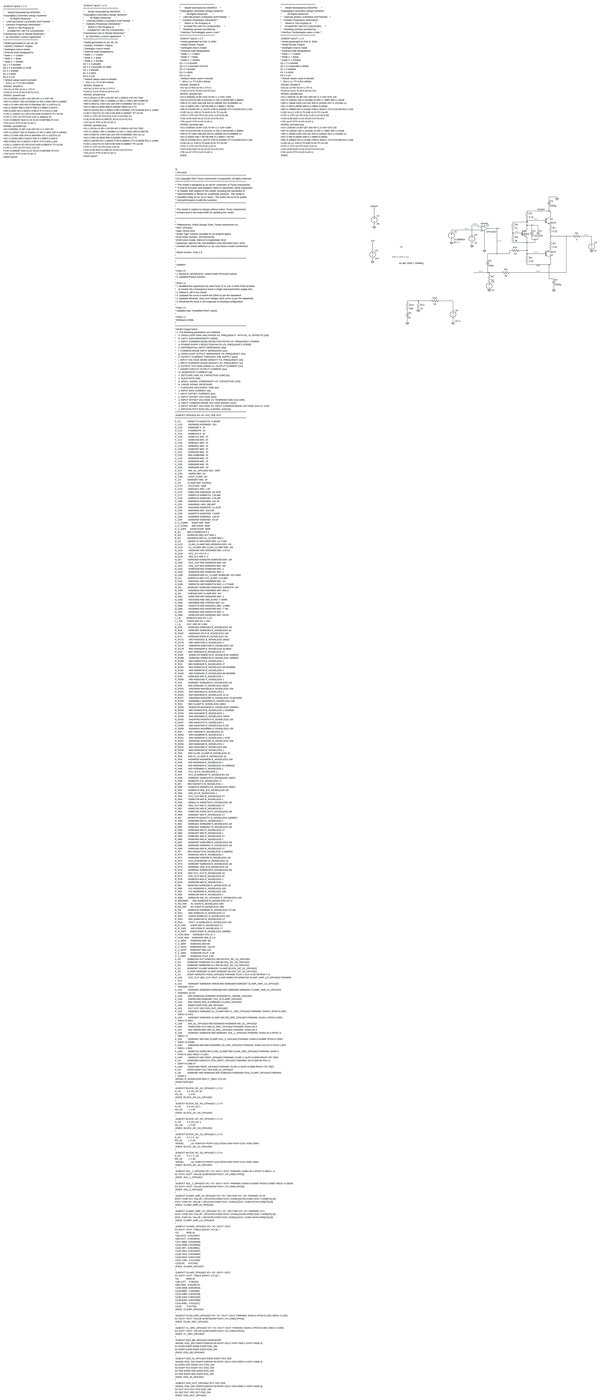
[diagram p0: schematic compensator.asc, whole sheet]
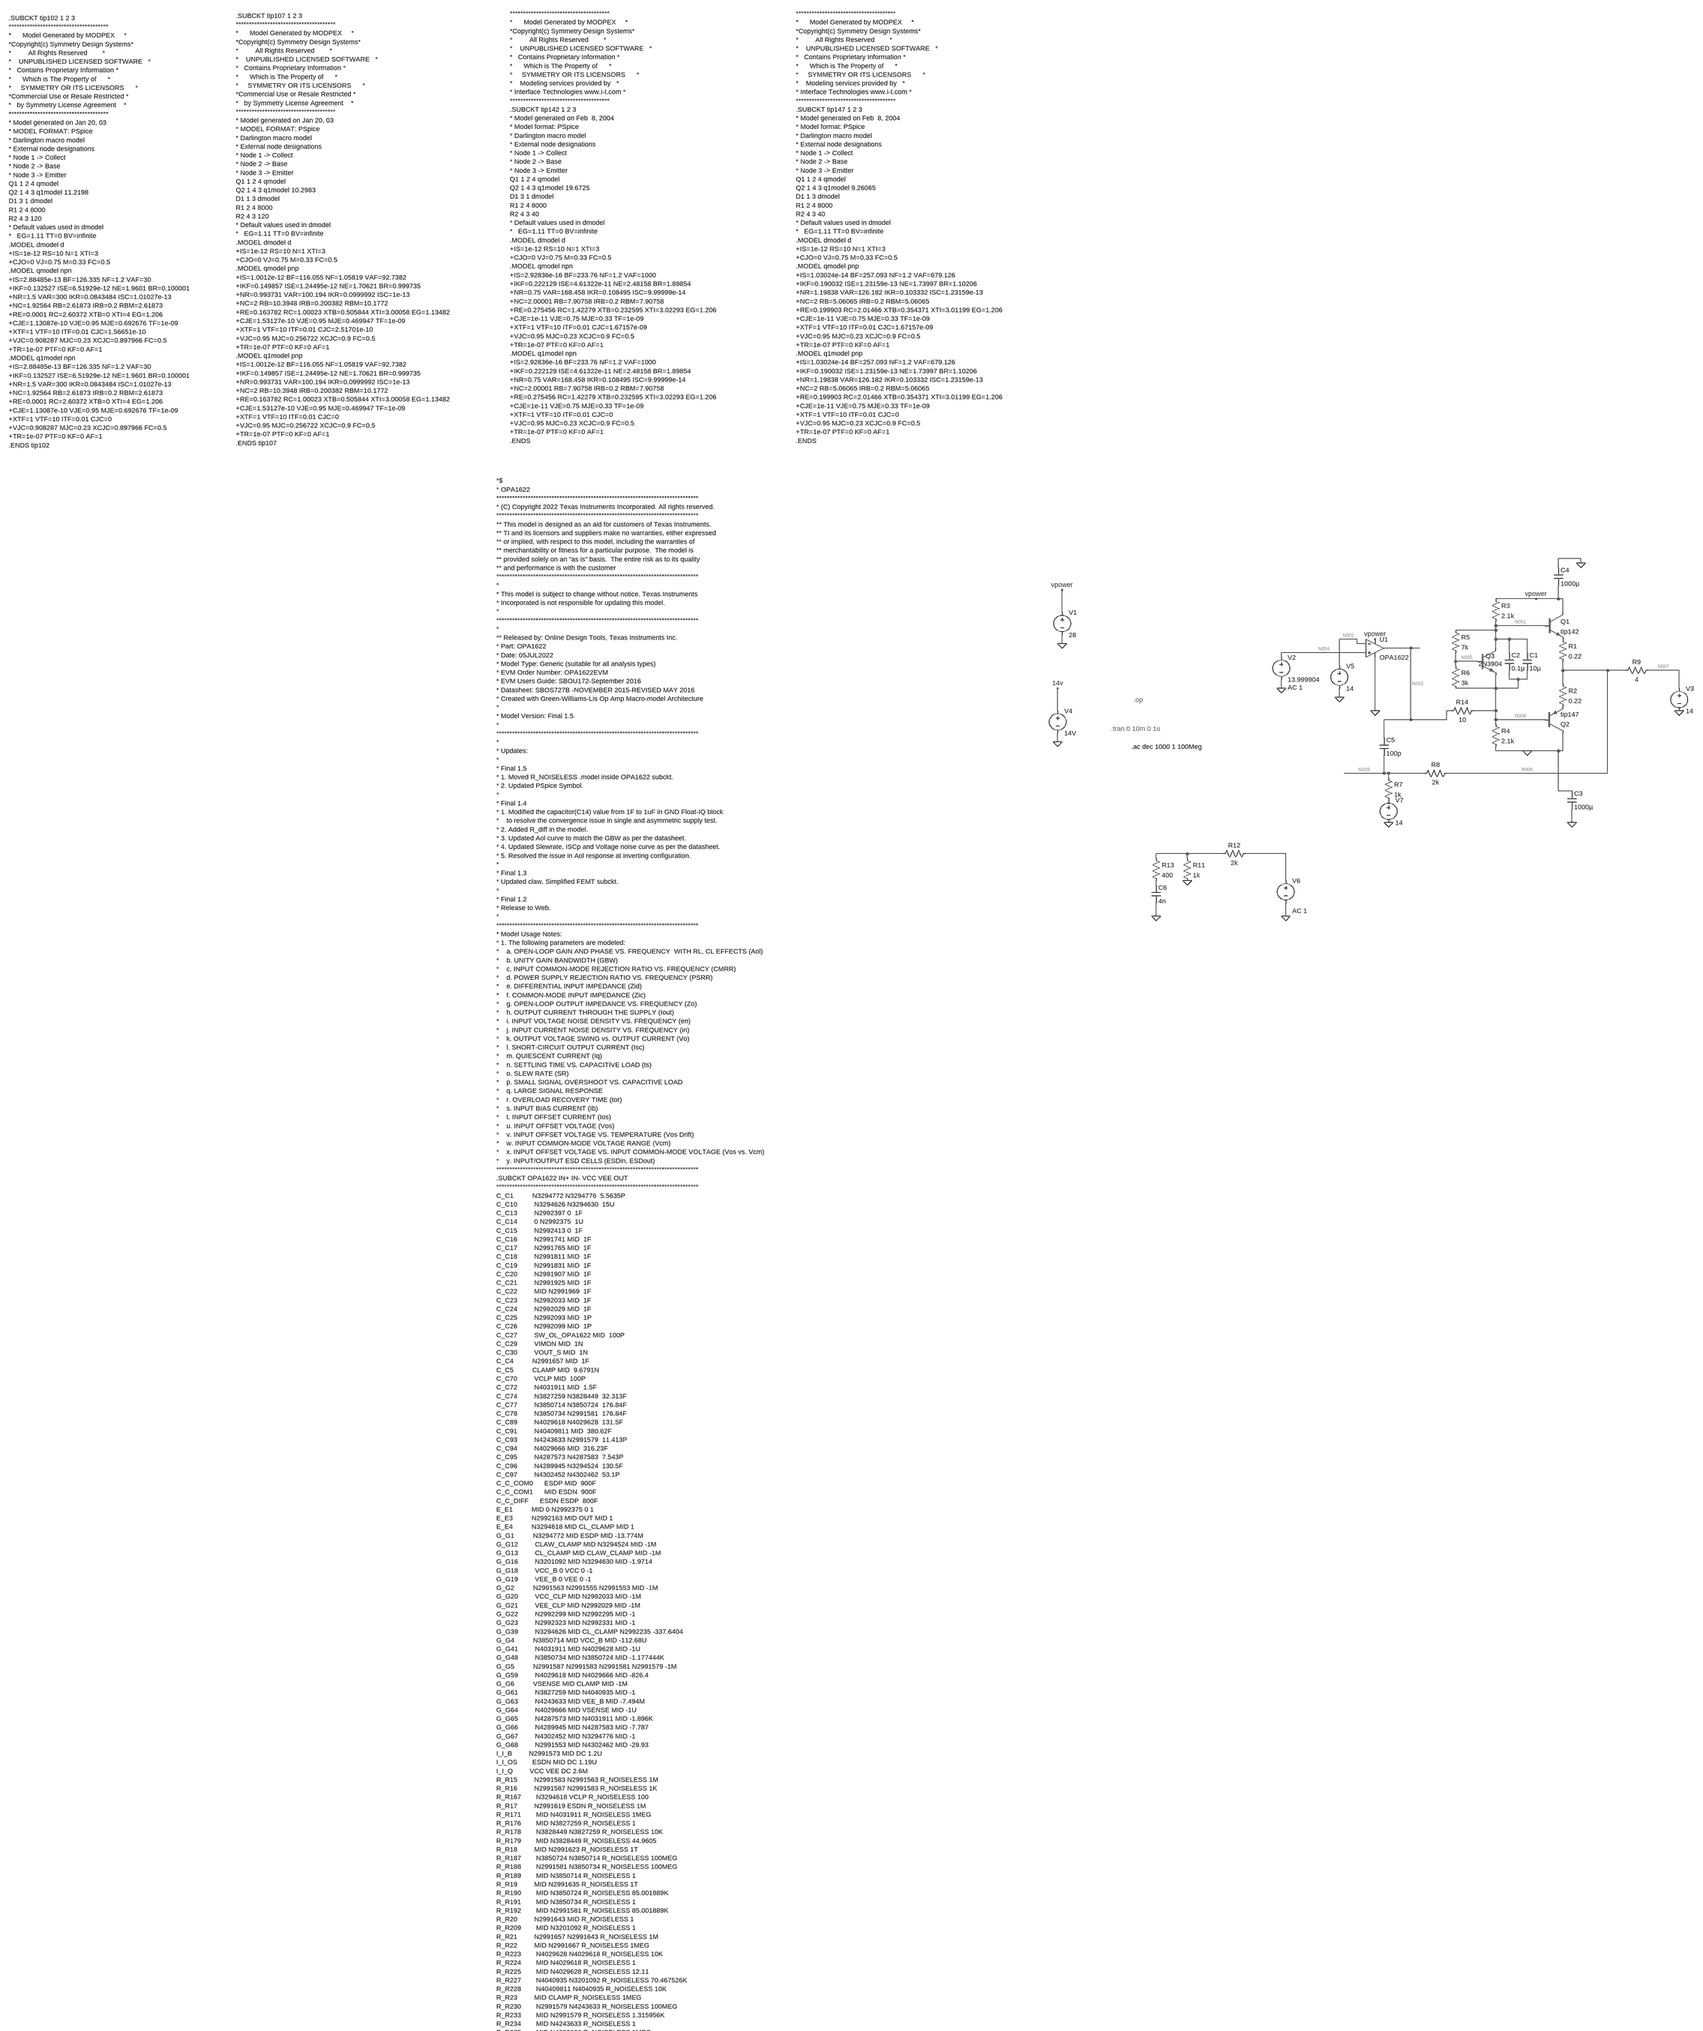
[diagram p1: schematic compensator.asc, part, row 1 of 2, column 1 of 1]
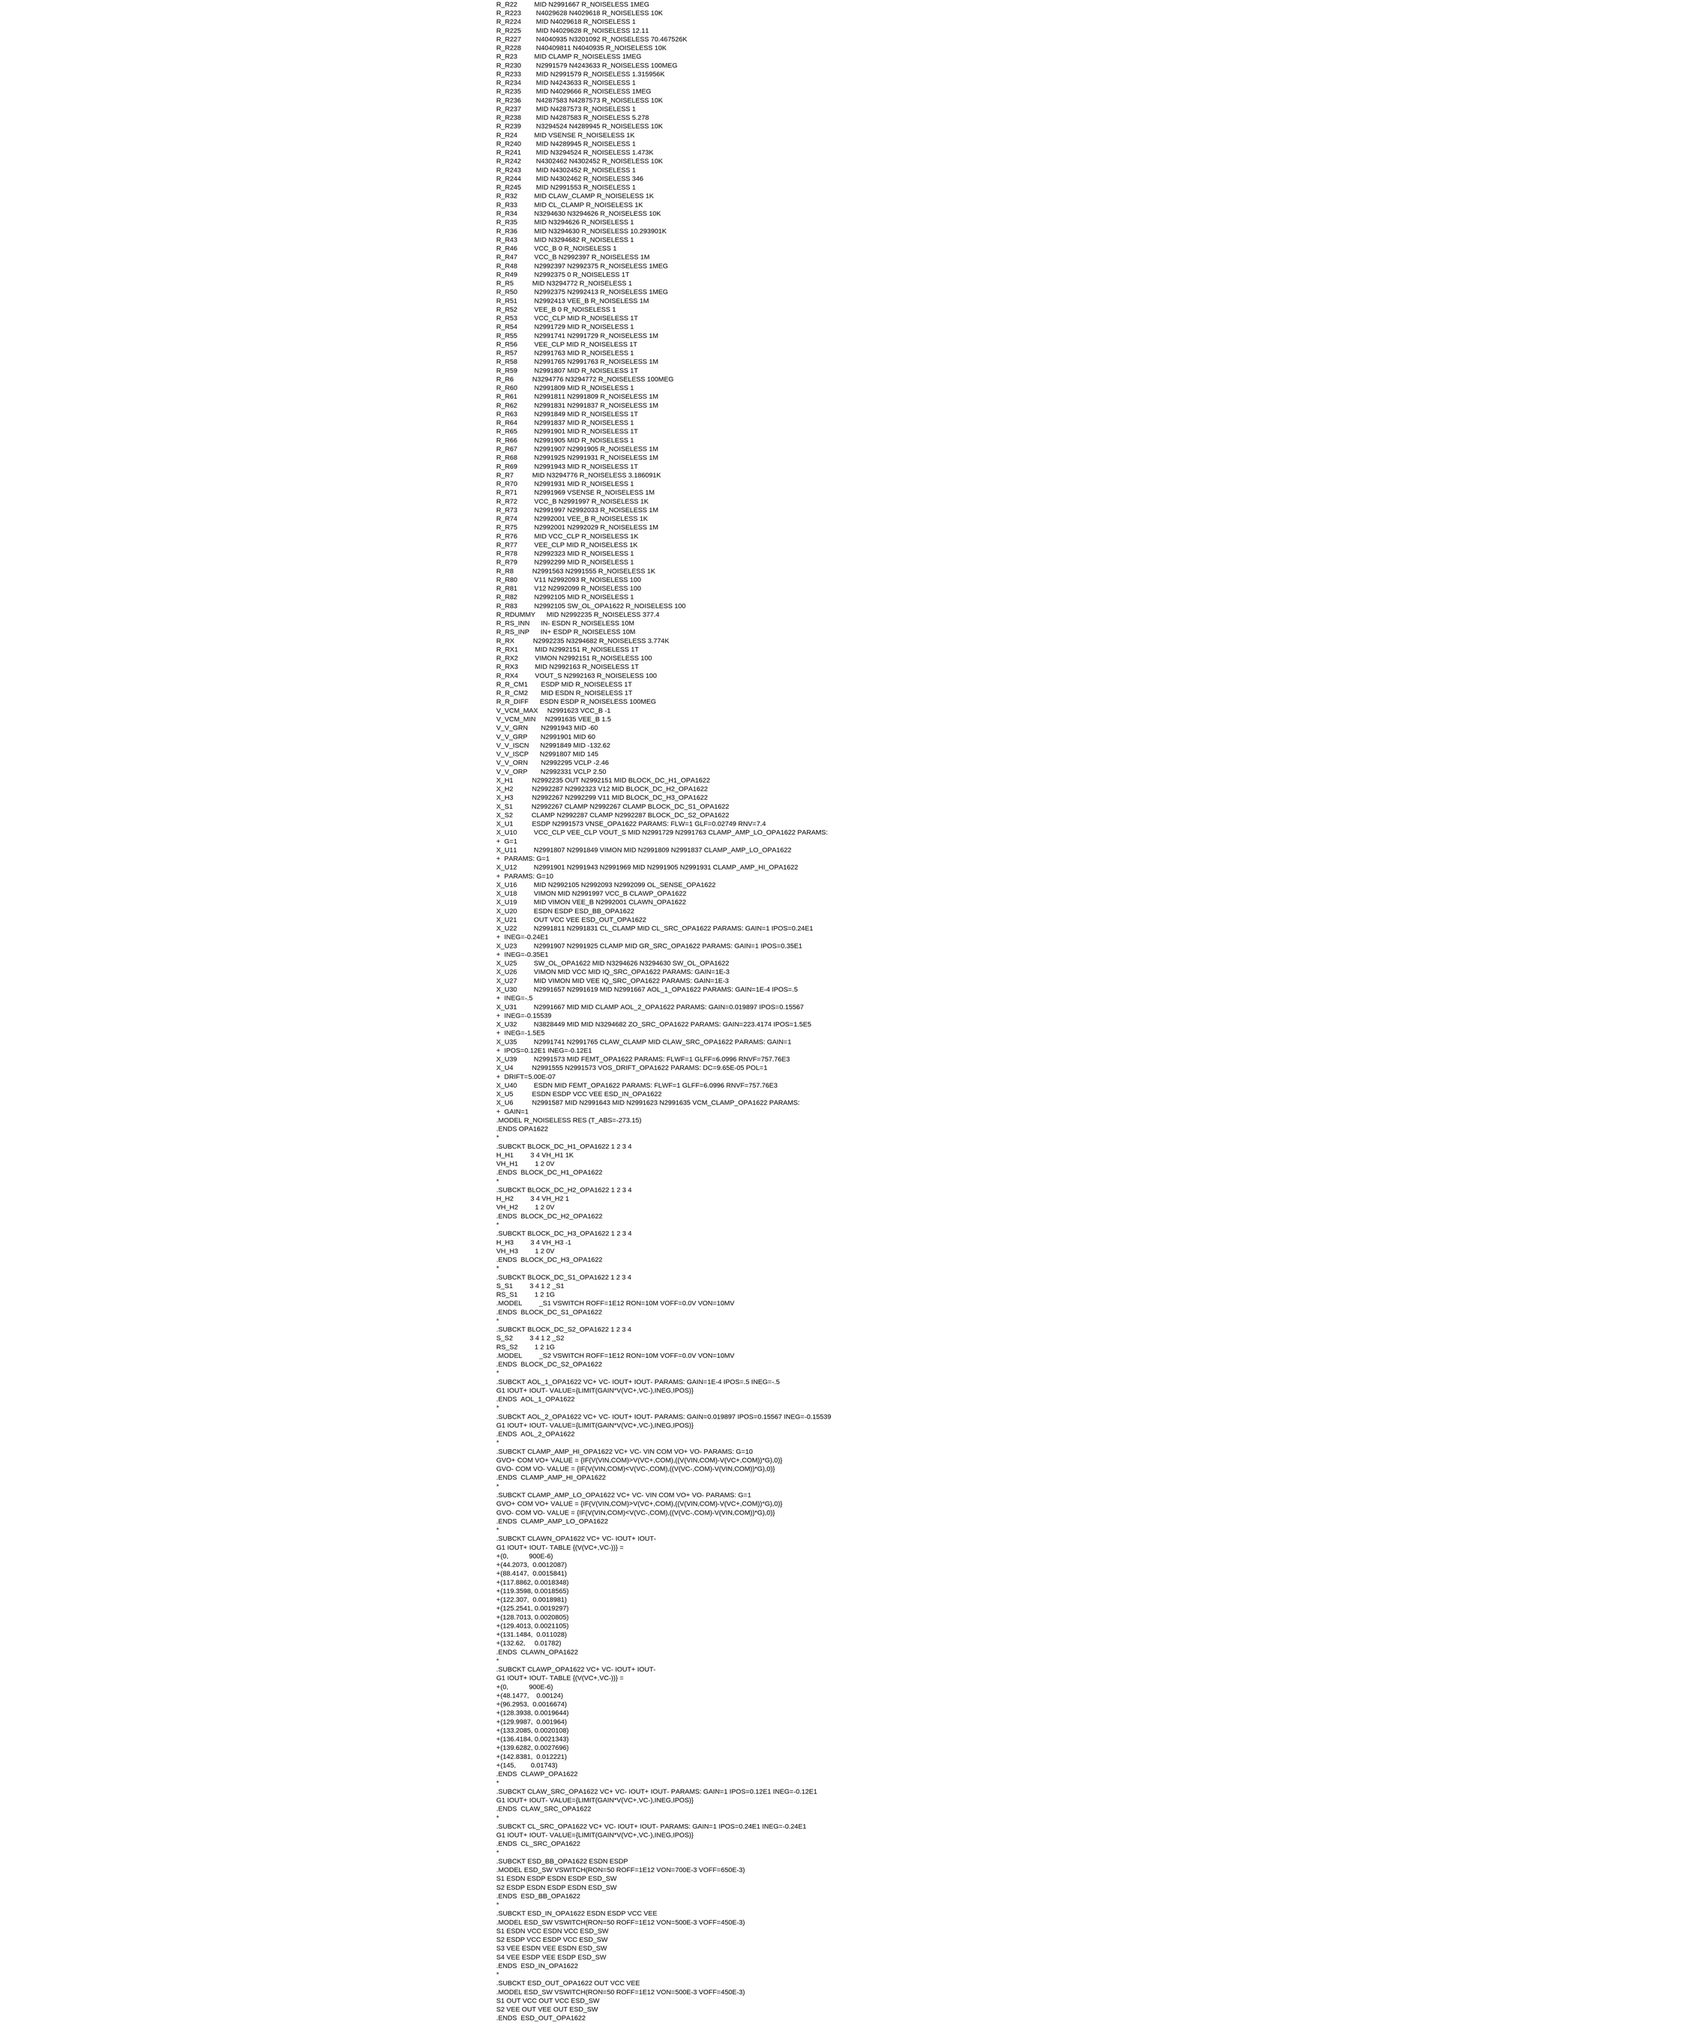
[diagram p2: schematic compensator.asc, part, row 2 of 2, column 1 of 1]
* compensator.asc
XQ1 vpower N001 P001 tip142  ; pins C B E
XQ2 0 N008 P002 tip147  ; pins C B E
R1 P001 N006 0.22
R2 N006 P002 0.22
R3 vpower N001 2.1k
R4 N008 0 2.1k
Q3 N001 N005 N008 0 2N3904
R5 N001 N005 7k
R6 N005 N008 3k
C1 N001 N008 10µ
C2 N001 N008 0.1µ
R7 N009 P003 1k
R8 N006 N009 2k
XU1 N004 N002 vpower 0 N003 OPA1622  ; pins In+ In- V+ V- OUT
V1 vpower 0 28
V4 14v 0 14V
V2 N004 0 13.999904 AC 1
R9 N007 N006 4
C3 0 0 1000µ
C4 0 vpower 1000µ
R11 N010 0 1k
R12 N011 N010 2k
R13 N010 N012 400
C6 N012 0 4n
V6 N011 0 AC 1
V3 N007 0 14
V5 N002 0 14
V7 P003 0 14
C5 N003 N009 100p
R14 N008 N003 10
.model NPN NPN
.model PNP PNP
.lib standard.bjt
**************************************
*      Model Generated by MODPEX     *
*Copyright(c) Symmetry Design Systems*
*         All Rights Reserved        *
*    UNPUBLISHED LICENSED SOFTWARE   *
*   Contains Proprietary Information *
*      Which is The Property of      *
*     SYMMETRY OR ITS LICENSORS      *
*    Modeling services provided by   *
* Interface Technologies www.i-t.com *
**************************************
.SUBCKT tip142 1 2 3
* Model generated on Feb  8, 2004
* Model format: PSpice
* Darlington macro model
* External node designations
* Node 1 -> Collect
* Node 2 -> Base
* Node 3 -> Emitter
Q1 1 2 4 qmodel
Q2 1 4 3 q1model 19.6725
D1 3 1 dmodel
R1 2 4 8000
R2 4 3 40
* Default values used in dmodel
*   EG=1.11 TT=0 BV=infinite
.MODEL dmodel d
+IS=1e-12 RS=10 N=1 XTI=3
+CJO=0 VJ=0.75 M=0.33 FC=0.5
.MODEL qmodel npn
+IS=2.92836e-16 BF=233.76 NF=1.2 VAF=1000
+IKF=0.222129 ISE=4.61322e-11 NE=2.48158 BR=1.89854
+NR=0.75 VAR=168.458 IKR=0.108495 ISC=9.99999e-14
+NC=2.00001 RB=7.90758 IRB=0.2 RBM=7.90758
+RE=0.275456 RC=1.42279 XTB=0.232595 XTI=3.02293 EG=1.206
+CJE=1e-11 VJE=0.75 MJE=0.33 TF=1e-09
+XTF=1 VTF=10 ITF=0.01 CJC=1.67157e-09
+VJC=0.95 MJC=0.23 XCJC=0.9 FC=0.5
+TR=1e-07 PTF=0 KF=0 AF=1
.MODEL q1model npn
+IS=2.92836e-16 BF=233.76 NF=1.2 VAF=1000
+IKF=0.222129 ISE=4.61322e-11 NE=2.48158 BR=1.89854
+NR=0.75 VAR=168.458 IKR=0.108495 ISC=9.99999e-14
+NC=2.00001 RB=7.90758 IRB=0.2 RBM=7.90758
+RE=0.275456 RC=1.42279 XTB=0.232595 XTI=3.02293 EG=1.206
+CJE=1e-11 VJE=0.75 MJE=0.33 TF=1e-09
+XTF=1 VTF=10 ITF=0.01 CJC=0
+VJC=0.95 MJC=0.23 XCJC=0.9 FC=0.5
+TR=1e-07 PTF=0 KF=0 AF=1
.ENDS
**************************************
*      Model Generated by MODPEX     *
*Copyright(c) Symmetry Design Systems*
*         All Rights Reserved        *
*    UNPUBLISHED LICENSED SOFTWARE   *
*   Contains Proprietary Information *
*      Which is The Property of      *
*     SYMMETRY OR ITS LICENSORS      *
*    Modeling services provided by   *
* Interface Technologies www.i-t.com *
**************************************
.SUBCKT tip147 1 2 3
* Model generated on Feb  8, 2004
* Model format: PSpice
* Darlington macro model
* External node designations
* Node 1 -> Collect
* Node 2 -> Base
* Node 3 -> Emitter
Q1 1 2 4 qmodel
Q2 1 4 3 q1model 9.26065
D1 1 3 dmodel
R1 2 4 8000
R2 4 3 40
* Default values used in dmodel
*   EG=1.11 TT=0 BV=infinite
.MODEL dmodel d
+IS=1e-12 RS=10 N=1 XTI=3
+CJO=0 VJ=0.75 M=0.33 FC=0.5
.MODEL qmodel pnp
+IS=1.03024e-14 BF=257.093 NF=1.2 VAF=679.126
+IKF=0.190032 ISE=1.23159e-13 NE=1.73997 BR=1.10206
+NR=1.19838 VAR=126.182 IKR=0.103332 ISC=1.23159e-13
+NC=2 RB=5.06065 IRB=0.2 RBM=5.06065
+RE=0.199903 RC=2.01466 XTB=0.354371 XTI=3.01199 EG=1.206
+CJE=1e-11 VJE=0.75 MJE=0.33 TF=1e-09
+XTF=1 VTF=10 ITF=0.01 CJC=1.67157e-09
+VJC=0.95 MJC=0.23 XCJC=0.9 FC=0.5
+TR=1e-07 PTF=0 KF=0 AF=1
.MODEL q1model pnp
+IS=1.03024e-14 BF=257.093 NF=1.2 VAF=679.126
+IKF=0.190032 ISE=1.23159e-13 NE=1.73997 BR=1.10206
+NR=1.19838 VAR=126.182 IKR=0.103332 ISC=1.23159e-13
+NC=2 RB=5.06065 IRB=0.2 RBM=5.06065
+RE=0.199903 RC=2.01466 XTB=0.354371 XTI=3.01199 EG=1.206
+CJE=1e-11 VJE=0.75 MJE=0.33 TF=1e-09
+XTF=1 VTF=10 ITF=0.01 CJC=0
+VJC=0.95 MJC=0.23 XCJC=0.9 FC=0.5
+TR=1e-07 PTF=0 KF=0 AF=1
.ENDS
*$
* OPA1622
*****************************************************************************
* (C) Copyright 2022 Texas Instruments Incorporated. All rights reserved.
*****************************************************************************
** This model is designed as an aid for customers of Texas Instruments.
** TI and its licensors and suppliers make no warranties, either expressed
** or implied, with respect to this model, including the warranties of
** merchantability or fitness for a particular purpose.  The model is
** provided solely on an "as is" basis.  The entire risk as to its quality
** and performance is with the customer
*****************************************************************************
*
* This model is subject to change without notice. Texas Instruments
* Incorporated is not responsible for updating this model.
*
*****************************************************************************
*
** Released by: Online Design Tools, Texas Instruments Inc.
* Part: OPA1622
* Date: 05JUL2022
* Model Type: Generic (suitable for all analysis types)
* EVM Order Number: OPA1622EVM
* EVM Users Guide: SBOU172-September 2016
* Datasheet: SBOS727B -NOVEMBER 2015-REVISED MAY 2016
* Created with Green-Williams-Lis Op Amp Macro-model Architecture
*
* Model Version: Final 1.5
*
*****************************************************************************
*
* Updates:
*
* Final 1.5
* 1. Moved R_NOISELESS .model inside OPA1622 subckt.
* 2. Updated PSpice Symbol.
*
* Final 1.4
* 1. Modified the capacitor(C14) value from 1F to 1uF in GND Float-IQ block
*    to resolve the convergence issue in single and asymmetric supply test.
* 2. Added R_diff in the model.
* 3. Updated Aol curve to match the GBW as per the datasheet.
* 4. Updated Slewrate, ISCp and Voltage noise curve as per the datasheet.
* 5. Resolved the issue in Aol response at inverting configuration.
*
* Final 1.3
* Updated claw, Simplified FEMT subckt.
*
* Final 1.2
* Release to Web.
*
*****************************************************************************
* Model Usage Notes:
* 1. The following parameters are modeled:
*    a. OPEN-LOOP GAIN AND PHASE VS. FREQUENCY  WITH RL, CL EFFECTS (Aol)
*    b. UNITY GAIN BANDWIDTH (GBW)
*    c. INPUT COMMON-MODE REJECTION RATIO VS. FREQUENCY (CMRR)
*    d. POWER SUPPLY REJECTION RATIO VS. FREQUENCY (PSRR)
*    e. DIFFERENTIAL INPUT IMPEDANCE (Zid)
*    f. COMMON-MODE INPUT IMPEDANCE (Zic)
*    g. OPEN-LOOP OUTPUT IMPEDANCE VS. FREQUENCY (Zo)
*    h. OUTPUT CURRENT THROUGH THE SUPPLY (Iout)
*    i. INPUT VOLTAGE NOISE DENSITY VS. FREQUENCY (en)
*    j. INPUT CURRENT NOISE DENSITY VS. FREQUENCY (in)
*    k. OUTPUT VOLTAGE SWING vs. OUTPUT CURRENT (Vo)
*    l. SHORT-CIRCUIT OUTPUT CURRENT (Isc)
*    m. QUIESCENT CURRENT (Iq)
*    n. SETTLING TIME VS. CAPACITIVE LOAD (ts)
*    o. SLEW RATE (SR)
*    p. SMALL SIGNAL OVERSHOOT VS. CAPACITIVE LOAD
*    q. LARGE SIGNAL RESPONSE
*    r. OVERLOAD RECOVERY TIME (tor)
*    s. INPUT BIAS CURRENT (Ib)
*    t. INPUT OFFSET CURRENT (Ios)
*    u. INPUT OFFSET VOLTAGE (Vos)
*    v. INPUT OFFSET VOLTAGE VS. TEMPERATURE (Vos Drift)
*    w. INPUT COMMON-MODE VOLTAGE RANGE (Vcm)
*    x. INPUT OFFSET VOLTAGE VS. INPUT COMMON-MODE VOLTAGE (Vos vs. Vcm)
*    y. INPUT/OUTPUT ESD CELLS (ESDin, ESDout)
*****************************************************************************
.SUBCKT OPA1622 IN+ IN- VCC VEE OUT
*****************************************************************************
C_C1          N3294772 N3294776  5.5635P
C_C10         N3294626 N3294630  15U
C_C13         N2992397 0  1F
C_C14         0 N2992375  1U
C_C15         N2992413 0  1F
C_C16         N2991741 MID  1F
C_C17         N2991765 MID  1F
C_C18         N2991811 MID  1F
C_C19         N2991831 MID  1F
C_C20         N2991907 MID  1F
C_C21         N2991925 MID  1F
C_C22         MID N2991969  1F
C_C23         N2992033 MID  1F
C_C24         N2992029 MID  1F
C_C25         N2992093 MID  1P
C_C26         N2992099 MID  1P
C_C27         SW_OL_OPA1622 MID  100P
C_C29         VIMON MID  1N
C_C30         VOUT_S MID  1N
C_C4          N2991657 MID  1F
C_C5          CLAMP MID  9.6791N
C_C70         VCLP MID  100P
C_C72         N4031911 MID  1.5F
C_C74         N3827259 N3828449  32.313F
C_C77         N3850714 N3850724  176.84F
C_C78         N3850734 N2991581  176.84F
C_C89         N4029618 N4029628  131.5F
C_C91         N40409811 MID  380.62F
C_C93         N4243633 N2991579  11.413P
C_C94         N4029666 MID  316.23F
C_C95         N4287573 N4287583  7.543P
C_C96         N4289945 N3294524  130.5F
C_C97         N4302452 N4302462  53.1P
C_C_COM0      ESDP MID  900F
C_C_COM1      MID ESDN  900F
C_C_DIFF      ESDN ESDP  800F
E_E1          MID 0 N2992375 0 1
E_E3          N2992163 MID OUT MID 1
E_E4          N3294618 MID CL_CLAMP MID 1
G_G1          N3294772 MID ESDP MID -13.774M
G_G12         CLAW_CLAMP MID N3294524 MID -1M
G_G13         CL_CLAMP MID CLAW_CLAMP MID -1M
G_G16         N3201092 MID N3294630 MID -1.9714
G_G18         VCC_B 0 VCC 0 -1
G_G19         VEE_B 0 VEE 0 -1
G_G2          N2991563 N2991555 N2991553 MID -1M
G_G20         VCC_CLP MID N2992033 MID -1M
G_G21         VEE_CLP MID N2992029 MID -1M
G_G22         N2992299 MID N2992295 MID -1
G_G23         N2992323 MID N2992331 MID -1
G_G39         N3294626 MID CL_CLAMP N2992235 -337.6404
G_G4          N3850714 MID VCC_B MID -112.68U
G_G41         N4031911 MID N4029628 MID -1U
G_G48         N3850734 MID N3850724 MID -1.177444K
G_G5          N2991587 N2991583 N2991581 N2991579 -1M
G_G59         N4029618 MID N4029666 MID -826.4
G_G6          VSENSE MID CLAMP MID -1M
G_G61         N3827259 MID N4040935 MID -1
G_G63         N4243633 MID VEE_B MID -7.494M
G_G64         N4029666 MID VSENSE MID -1U
G_G65         N4287573 MID N4031911 MID -1.896K
G_G66         N4289945 MID N4287583 MID -7.787
G_G67         N4302452 MID N3294776 MID -1
G_G68         N2991553 MID N4302462 MID -29.93
I_I_B         N2991573 MID DC 1.2U
I_I_OS        ESDN MID DC 1.19U
I_I_Q         VCC VEE DC 2.6M
R_R15         N2991583 N2991563 R_NOISELESS 1M
R_R16         N2991587 N2991583 R_NOISELESS 1K
R_R167        N3294618 VCLP R_NOISELESS 100
R_R17         N2991619 ESDN R_NOISELESS 1M
R_R171        MID N4031911 R_NOISELESS 1MEG
R_R176        MID N3827259 R_NOISELESS 1
R_R178        N3828449 N3827259 R_NOISELESS 10K
R_R179        MID N3828449 R_NOISELESS 44.9605
R_R18         MID N2991623 R_NOISELESS 1T
R_R187        N3850724 N3850714 R_NOISELESS 100MEG
R_R188        N2991581 N3850734 R_NOISELESS 100MEG
R_R189        MID N3850714 R_NOISELESS 1
R_R19         MID N2991635 R_NOISELESS 1T
R_R190        MID N3850724 R_NOISELESS 85.001889K
R_R191        MID N3850734 R_NOISELESS 1
R_R192        MID N2991581 R_NOISELESS 85.001889K
R_R20         N2991643 MID R_NOISELESS 1
R_R209        MID N3201092 R_NOISELESS 1
R_R21         N2991657 N2991643 R_NOISELESS 1M
R_R22         MID N2991667 R_NOISELESS 1MEG
R_R223        N4029628 N4029618 R_NOISELESS 10K
R_R224        MID N4029618 R_NOISELESS 1
R_R225        MID N4029628 R_NOISELESS 12.11
R_R227        N4040935 N3201092 R_NOISELESS 70.467526K
R_R228        N40409811 N4040935 R_NOISELESS 10K
R_R23         MID CLAMP R_NOISELESS 1MEG
R_R230        N2991579 N4243633 R_NOISELESS 100MEG
R_R233        MID N2991579 R_NOISELESS 1.315956K
R_R234        MID N4243633 R_NOISELESS 1
R_R235        MID N4029666 R_NOISELESS 1MEG
R_R236        N4287583 N4287573 R_NOISELESS 10K
R_R237        MID N4287573 R_NOISELESS 1
R_R238        MID N4287583 R_NOISELESS 5.278
R_R239        N3294524 N4289945 R_NOISELESS 10K
R_R24         MID VSENSE R_NOISELESS 1K
R_R240        MID N4289945 R_NOISELESS 1
R_R241        MID N3294524 R_NOISELESS 1.473K
R_R242        N4302462 N4302452 R_NOISELESS 10K
R_R243        MID N4302452 R_NOISELESS 1
R_R244        MID N4302462 R_NOISELESS 346
R_R245        MID N2991553 R_NOISELESS 1
R_R32         MID CLAW_CLAMP R_NOISELESS 1K
R_R33         MID CL_CLAMP R_NOISELESS 1K
R_R34         N3294630 N3294626 R_NOISELESS 10K
R_R35         MID N3294626 R_NOISELESS 1
R_R36         MID N3294630 R_NOISELESS 10.293901K
R_R43         MID N3294682 R_NOISELESS 1
R_R46         VCC_B 0 R_NOISELESS 1
R_R47         VCC_B N2992397 R_NOISELESS 1M
R_R48         N2992397 N2992375 R_NOISELESS 1MEG
R_R49         N2992375 0 R_NOISELESS 1T
R_R5          MID N3294772 R_NOISELESS 1
R_R50         N2992375 N2992413 R_NOISELESS 1MEG
R_R51         N2992413 VEE_B R_NOISELESS 1M
R_R52         VEE_B 0 R_NOISELESS 1
R_R53         VCC_CLP MID R_NOISELESS 1T
R_R54         N2991729 MID R_NOISELESS 1
R_R55         N2991741 N2991729 R_NOISELESS 1M
R_R56         VEE_CLP MID R_NOISELESS 1T
R_R57         N2991763 MID R_NOISELESS 1
R_R58         N2991765 N2991763 R_NOISELESS 1M
R_R59         N2991807 MID R_NOISELESS 1T
R_R6          N3294776 N3294772 R_NOISELESS 100MEG
R_R60         N2991809 MID R_NOISELESS 1
R_R61         N2991811 N2991809 R_NOISELESS 1M
R_R62         N2991831 N2991837 R_NOISELESS 1M
R_R63         N2991849 MID R_NOISELESS 1T
R_R64         N2991837 MID R_NOISELESS 1
R_R65         N2991901 MID R_NOISELESS 1T
R_R66         N2991905 MID R_NOISELESS 1
R_R67         N2991907 N2991905 R_NOISELESS 1M
R_R68         N2991925 N2991931 R_NOISELESS 1M
R_R69         N2991943 MID R_NOISELESS 1T
R_R7          MID N3294776 R_NOISELESS 3.186091K
R_R70         N2991931 MID R_NOISELESS 1
R_R71         N2991969 VSENSE R_NOISELESS 1M
R_R72         VCC_B N2991997 R_NOISELESS 1K
R_R73         N2991997 N2992033 R_NOISELESS 1M
R_R74         N2992001 VEE_B R_NOISELESS 1K
R_R75         N2992001 N2992029 R_NOISELESS 1M
R_R76         MID VCC_CLP R_NOISELESS 1K
R_R77         VEE_CLP MID R_NOISELESS 1K
R_R78         N2992323 MID R_NOISELESS 1
R_R79         N2992299 MID R_NOISELESS 1
R_R8          N2991563 N2991555 R_NOISELESS 1K
R_R80         V11 N2992093 R_NOISELESS 100
R_R81         V12 N2992099 R_NOISELESS 100
R_R82         N2992105 MID R_NOISELESS 1
R_R83         N2992105 SW_OL_OPA1622 R_NOISELESS 100
R_RDUMMY      MID N2992235 R_NOISELESS 377.4
R_RS_INN      IN- ESDN R_NOISELESS 10M
R_RS_INP      IN+ ESDP R_NOISELESS 10M
R_RX          N2992235 N3294682 R_NOISELESS 3.774K
R_RX1         MID N2992151 R_NOISELESS 1T
R_RX2         VIMON N2992151 R_NOISELESS 100
R_RX3         MID N2992163 R_NOISELESS 1T
R_RX4         VOUT_S N2992163 R_NOISELESS 100
R_R_CM1       ESDP MID R_NOISELESS 1T
R_R_CM2       MID ESDN R_NOISELESS 1T
R_R_DIFF      ESDN ESDP R_NOISELESS 100MEG
V_VCM_MAX     N2991623 VCC_B -1
V_VCM_MIN     N2991635 VEE_B 1.5
V_V_GRN       N2991943 MID -60
V_V_GRP       N2991901 MID 60
V_V_ISCN      N2991849 MID -132.62
V_V_ISCP      N2991807 MID 145
V_V_ORN       N2992295 VCLP -2.46
V_V_ORP       N2992331 VCLP 2.50
X_H1          N2992235 OUT N2992151 MID BLOCK_DC_H1_OPA1622
X_H2          N2992287 N2992323 V12 MID BLOCK_DC_H2_OPA1622
X_H3          N2992267 N2992299 V11 MID BLOCK_DC_H3_OPA1622
X_S1          N2992267 CLAMP N2992267 CLAMP BLOCK_DC_S1_OPA1622
X_S2          CLAMP N2992287 CLAMP N2992287 BLOCK_DC_S2_OPA1622
X_U1          ESDP N2991573 VNSE_OPA1622 PARAMS: FLW=1 GLF=0.02749 RNV=7.4
X_U10         VCC_CLP VEE_CLP VOUT_S MID N2991729 N2991763 CLAMP_AMP_LO_OPA1622 PARAMS:
+  G=1
X_U11         N2991807 N2991849 VIMON MID N2991809 N2991837 CLAMP_AMP_LO_OPA1622
+  PARAMS: G=1
X_U12         N2991901 N2991943 N2991969 MID N2991905 N2991931 CLAMP_AMP_HI_OPA1622
+  PARAMS: G=10
X_U16         MID N2992105 N2992093 N2992099 OL_SENSE_OPA1622
X_U18         VIMON MID N2991997 VCC_B CLAWP_OPA1622
X_U19         MID VIMON VEE_B N2992001 CLAWN_OPA1622
X_U20         ESDN ESDP ESD_BB_OPA1622
X_U21         OUT VCC VEE ESD_OUT_OPA1622
X_U22         N2991811 N2991831 CL_CLAMP MID CL_SRC_OPA1622 PARAMS: GAIN=1 IPOS=0.24E1
+  INEG=-0.24E1
X_U23         N2991907 N2991925 CLAMP MID GR_SRC_OPA1622 PARAMS: GAIN=1 IPOS=0.35E1
+  INEG=-0.35E1
X_U25         SW_OL_OPA1622 MID N3294626 N3294630 SW_OL_OPA1622
X_U26         VIMON MID VCC MID IQ_SRC_OPA1622 PARAMS: GAIN=1E-3
X_U27         MID VIMON MID VEE IQ_SRC_OPA1622 PARAMS: GAIN=1E-3
X_U30         N2991657 N2991619 MID N2991667 AOL_1_OPA1622 PARAMS: GAIN=1E-4 IPOS=.5
+  INEG=-.5
X_U31         N2991667 MID MID CLAMP AOL_2_OPA1622 PARAMS: GAIN=0.019897 IPOS=0.15567
+  INEG=-0.15539
X_U32         N3828449 MID MID N3294682 ZO_SRC_OPA1622 PARAMS: GAIN=223.4174 IPOS=1.5E5
+  INEG=-1.5E5
X_U35         N2991741 N2991765 CLAW_CLAMP MID CLAW_SRC_OPA1622 PARAMS: GAIN=1
+  IPOS=0.12E1 INEG=-0.12E1
X_U39         N2991573 MID FEMT_OPA1622 PARAMS: FLWF=1 GLFF=6.0996 RNVF=757.76E3
X_U4          N2991555 N2991573 VOS_DRIFT_OPA1622 PARAMS: DC=9.65E-05 POL=1
+  DRIFT=5.00E-07
X_U40         ESDN MID FEMT_OPA1622 PARAMS: FLWF=1 GLFF=6.0996 RNVF=757.76E3
X_U5          ESDN ESDP VCC VEE ESD_IN_OPA1622
X_U6          N2991587 MID N2991643 MID N2991623 N2991635 VCM_CLAMP_OPA1622 PARAMS:
+  GAIN=1
.MODEL R_NOISELESS RES (T_ABS=-273.15)
.ENDS OPA1622
*
.SUBCKT BLOCK_DC_H1_OPA1622 1 2 3 4
H_H1         3 4 VH_H1 1K
VH_H1         1 2 0V
.ENDS  BLOCK_DC_H1_OPA1622
*
.SUBCKT BLOCK_DC_H2_OPA1622 1 2 3 4
H_H2         3 4 VH_H2 1
VH_H2         1 2 0V
.ENDS  BLOCK_DC_H2_OPA1622
*
.SUBCKT BLOCK_DC_H3_OPA1622 1 2 3 4
H_H3         3 4 VH_H3 -1
VH_H3         1 2 0V
.ENDS  BLOCK_DC_H3_OPA1622
*
.SUBCKT BLOCK_DC_S1_OPA1622 1 2 3 4
S_S1         3 4 1 2 _S1
RS_S1         1 2 1G
.MODEL         _S1 VSWITCH ROFF=1E12 RON=10M VOFF=0.0V VON=10MV
.ENDS  BLOCK_DC_S1_OPA1622
*
.SUBCKT BLOCK_DC_S2_OPA1622 1 2 3 4
S_S2         3 4 1 2 _S2
RS_S2         1 2 1G
.MODEL         _S2 VSWITCH ROFF=1E12 RON=10M VOFF=0.0V VON=10MV
.ENDS  BLOCK_DC_S2_OPA1622
*
.SUBCKT AOL_1_OPA1622 VC+ VC- IOUT+ IOUT- PARAMS: GAIN=1E-4 IPOS=.5 INEG=-.5
G1 IOUT+ IOUT- VALUE={LIMIT(GAIN*V(VC+,VC-),INEG,IPOS)}
.ENDS  AOL_1_OPA1622
*
.SUBCKT AOL_2_OPA1622 VC+ VC- IOUT+ IOUT- PARAMS: GAIN=0.019897 IPOS=0.15567 INEG=-0.15539
G1 IOUT+ IOUT- VALUE={LIMIT(GAIN*V(VC+,VC-),INEG,IPOS)}
.ENDS  AOL_2_OPA1622
*
.SUBCKT CLAMP_AMP_HI_OPA1622 VC+ VC- VIN COM VO+ VO- PARAMS: G=10
GVO+ COM VO+ VALUE = {IF(V(VIN,COM)>V(VC+,COM),((V(VIN,COM)-V(VC+,COM))*G),0)}
GVO- COM VO- VALUE = {IF(V(VIN,COM)<V(VC-,COM),((V(VC-,COM)-V(VIN,COM))*G),0)}
.ENDS  CLAMP_AMP_HI_OPA1622
*
.SUBCKT CLAMP_AMP_LO_OPA1622 VC+ VC- VIN COM VO+ VO- PARAMS: G=1
GVO+ COM VO+ VALUE = {IF(V(VIN,COM)>V(VC+,COM),((V(VIN,COM)-V(VC+,COM))*G),0)}
GVO- COM VO- VALUE = {IF(V(VIN,COM)<V(VC-,COM),((V(VC-,COM)-V(VIN,COM))*G),0)}
.ENDS  CLAMP_AMP_LO_OPA1622
*
.SUBCKT CLAWN_OPA1622 VC+ VC- IOUT+ IOUT-
G1 IOUT+ IOUT- TABLE {(V(VC+,VC-))} =
+(0,           900E-6)
+(44.2073,  0.0012087)
+(88.4147,  0.0015841)
+(117.8862, 0.0018348)
+(119.3598, 0.0018565)
+(122.307,  0.0018981)
+(125.2541, 0.0019297)
+(128.7013, 0.0020805)
+(129.4013, 0.0021105)
+(131.1484,  0.011028)
+(132.62,     0.01782)
.ENDS  CLAWN_OPA1622
*
.SUBCKT CLAWP_OPA1622 VC+ VC- IOUT+ IOUT-
G1 IOUT+ IOUT- TABLE {(V(VC+,VC-))} =
+(0,           900E-6)
+(48.1477,    0.00124)
+(96.2953,  0.0016674)
+(128.3938, 0.0019644)
+(129.9987,  0.001964)
+(133.2085, 0.0020108)
+(136.4184, 0.0021343)
+(139.6282, 0.0027696)
+(142.8381,  0.012221)
+(145,        0.01743)
.ENDS  CLAWP_OPA1622
*
.SUBCKT CLAW_SRC_OPA1622 VC+ VC- IOUT+ IOUT- PARAMS: GAIN=1 IPOS=0.12E1 INEG=-0.12E1
G1 IOUT+ IOUT- VALUE={LIMIT(GAIN*V(VC+,VC-),INEG,IPOS)}
.ENDS  CLAW_SRC_OPA1622
*
.SUBCKT CL_SRC_OPA1622 VC+ VC- IOUT+ IOUT- PARAMS: GAIN=1 IPOS=0.24E1 INEG=-0.24E1
G1 IOUT+ IOUT- VALUE={LIMIT(GAIN*V(VC+,VC-),INEG,IPOS)}
.ENDS  CL_SRC_OPA1622
*
.SUBCKT ESD_BB_OPA1622 ESDN ESDP
.MODEL ESD_SW VSWITCH(RON=50 ROFF=1E12 VON=700E-3 VOFF=650E-3)
S1 ESDN ESDP ESDN ESDP ESD_SW
S2 ESDP ESDN ESDP ESDN ESD_SW
.ENDS  ESD_BB_OPA1622
*
.SUBCKT ESD_IN_OPA1622 ESDN ESDP VCC VEE
.MODEL ESD_SW VSWITCH(RON=50 ROFF=1E12 VON=500E-3 VOFF=450E-3)
S1 ESDN VCC ESDN VCC ESD_SW
S2 ESDP VCC ESDP VCC ESD_SW
S3 VEE ESDN VEE ESDN ESD_SW
S4 VEE ESDP VEE ESDP ESD_SW
.ENDS  ESD_IN_OPA1622
*
.SUBCKT ESD_OUT_OPA1622 OUT VCC VEE
.MODEL ESD_SW VSWITCH(RON=50 ROFF=1E12 VON=500E-3 VOFF=450E-3)
S1 OUT VCC OUT VCC ESD_SW
S2 VEE OUT VEE OUT ESD_SW
.ENDS  ESD_OUT_OPA1622
*
.SUBCKT FEMT_OPA1622 1 2 PARAMS: FLWF=1 GLFF=6.0996 RNVF=757.76E3
.MODEL DVNF D KF={PWR(FLWF,0.5)/1E11} IS=1.0E-16
I1 0 7 10E-3
I2 0 8 10E-3
D1 7 0 DVNF
D2 8 0 DVNF
E1 3 6 7 8 {GLFF}
R1 3 0 1E9
R2 3 0 1E9
R3 3 6 1E9
E2 6 4 5 0 10
R4 5 0 {RNVF}
R5 5 0 {RNVF}
R6 3 4 1E9
R7 4 0 1E9
G1 1 2 3 4 1E-6
.ENDS  FEMT_OPA1622
*
.SUBCKT GR_SRC_OPA1622 VC+ VC- IOUT+ IOUT- PARAMS: GAIN=1 IPOS=0.35E1 INEG=-0.35E1
G1 IOUT+ IOUT- VALUE={LIMIT(GAIN*V(VC+,VC-),INEG,IPOS)}
.ENDS  GR_SRC_OPA1622
*
.SUBCKT IQ_SRC_OPA1622 VC+ VC- IOUT+ IOUT- PARAMS: GAIN=1E-3
G1 IOUT+ IOUT- VALUE={IF( (V(VC+,VC-)<=0),0,GAIN*V(VC+,VC-) )}
.ENDS  IQ_SRC_OPA1622
*
.SUBCKT OL_SENSE_OPA1622 COM SW+ OLN OLP
GSW+ COM SW+ VALUE = {IF((V(OLN,COM)>10E-3 | V(OLP,COM)>10E-3),1,0)}
.ENDS  OL_SENSE_OPA1622
*
.SUBCKT SW_OL_OPA1622 SW_OL_OPA1622 MID CAP_L CAP_R
.MODEL OL_SW VSWITCH(RON=1E-3 ROFF=1E12 VON=900E-3 VOFF=800E-3)
S1 CAP_L CAP_R SW_OL_OPA1622 MID OL_SW
.ENDS  SW_OL_OPA1622
*
.SUBCKT VCM_CLAMP_OPA1622 VIN+ VIN- IOUT- IOUT+ VP+ VP- PARAMS: GAIN=1
G1 IOUT+ IOUT- VALUE={LIMIT(GAIN*V(VIN+,VIN-),V(VP-,VIN-), V(VP+,VIN-))}
.ENDS  VCM_CLAMP_OPA1622
*
.SUBCKT VNSE_OPA1622 1 2 PARAMS: FLW=1 GLF=0.02749 RNV=7.4
.MODEL DVN D KF={PWR(FLW,0.5)/1E11} IS=1.0E-16
I1 0 7 10E-3
I2 0 8 10E-3
D1 7 0 DVN
D2 8 0 DVN
E1 3 6 7 8 {GLF}
R1 3 0 1E9
R2 3 0 1E9
R3 3 6 1E9
E2 6 4 5 0 10
R4 5 0 {RNV}
R5 5 0 {RNV}
R6 3 4 1E9
R7 4 0 1E9
E3 1 2 3 4 1
.ENDS  VNSE_OPA1622
*
.SUBCKT VOS_DRIFT_OPA1622 VOS+ VOS- PARAMS: DC=9.65E-05 POL=1 DRIFT=5.00E-07
E1 VOS+ VOS- VALUE={DC+POL*DRIFT*(TEMP-27)}
.ENDS  VOS_DRIFT_OPA1622
*
.SUBCKT ZO_SRC_OPA1622 VC+ VC- IOUT+ IOUT- PARAMS: GAIN=223.4174 IPOS=1.5E5 INEG=-1.5E5
G1 IOUT+ IOUT- VALUE={LIMIT(GAIN*V(VC+,VC-),INEG,IPOS)}
.ENDS  ZO_SRC_OPA1622
*
* .tran 0 10m 0 1u
* .op
.ac dec 1000 1 100Meg
.SUBCKT tip107 1 2 3
**************************************
*      Model Generated by MODPEX     *
*Copyright(c) Symmetry Design Systems*
*         All Rights Reserved        *
*    UNPUBLISHED LICENSED SOFTWARE   *
*   Contains Proprietary Information *
*      Which is The Property of      *
*     SYMMETRY OR ITS LICENSORS      *
*Commercial Use or Resale Restricted *
*   by Symmetry License Agreement    *
**************************************
* Model generated on Jan 20, 03
* MODEL FORMAT: PSpice
* Darlington macro model
* External node designations
* Node 1 -> Collect
* Node 2 -> Base
* Node 3 -> Emitter
Q1 1 2 4 qmodel
Q2 1 4 3 q1model 10.2983
D1 1 3 dmodel
R1 2 4 8000
R2 4 3 120
* Default values used in dmodel
*   EG=1.11 TT=0 BV=infinite
.MODEL dmodel d
+IS=1e-12 RS=10 N=1 XTI=3
+CJO=0 VJ=0.75 M=0.33 FC=0.5
.MODEL qmodel pnp
+IS=1.0012e-12 BF=116.055 NF=1.05819 VAF=92.7382
+IKF=0.149857 ISE=1.24495e-12 NE=1.70621 BR=0.999735
+NR=0.993731 VAR=100.194 IKR=0.0999992 ISC=1e-13
+NC=2 RB=10.3948 IRB=0.200382 RBM=10.1772
+RE=0.163782 RC=1.00023 XTB=0.505844 XTI=3.00058 EG=1.13482
+CJE=1.53127e-10 VJE=0.95 MJE=0.469947 TF=1e-09
+XTF=1 VTF=10 ITF=0.01 CJC=2.51701e-10
+VJC=0.95 MJC=0.256722 XCJC=0.9 FC=0.5
+TR=1e-07 PTF=0 KF=0 AF=1
.MODEL q1model pnp
+IS=1.0012e-12 BF=116.055 NF=1.05819 VAF=92.7382
+IKF=0.149857 ISE=1.24495e-12 NE=1.70621 BR=0.999735
+NR=0.993731 VAR=100.194 IKR=0.0999992 ISC=1e-13
+NC=2 RB=10.3948 IRB=0.200382 RBM=10.1772
+RE=0.163782 RC=1.00023 XTB=0.505844 XTI=3.00058 EG=1.13482
+CJE=1.53127e-10 VJE=0.95 MJE=0.469947 TF=1e-09
+XTF=1 VTF=10 ITF=0.01 CJC=0
+VJC=0.95 MJC=0.256722 XCJC=0.9 FC=0.5
+TR=1e-07 PTF=0 KF=0 AF=1
.ENDS tip107
.SUBCKT tip102 1 2 3
**************************************
*      Model Generated by MODPEX     *
*Copyright(c) Symmetry Design Systems*
*         All Rights Reserved        *
*    UNPUBLISHED LICENSED SOFTWARE   *
*   Contains Proprietary Information *
*      Which is The Property of      *
*     SYMMETRY OR ITS LICENSORS      *
*Commercial Use or Resale Restricted *
*   by Symmetry License Agreement    *
**************************************
* Model generated on Jan 20, 03
* MODEL FORMAT: PSpice
* Darlington macro model
* External node designations
* Node 1 -> Collect
* Node 2 -> Base
* Node 3 -> Emitter
Q1 1 2 4 qmodel
Q2 1 4 3 q1model 11.2198
D1 3 1 dmodel
R1 2 4 8000
R2 4 3 120
* Default values used in dmodel
*   EG=1.11 TT=0 BV=infinite
.MODEL dmodel d
+IS=1e-12 RS=10 N=1 XTI=3
+CJO=0 VJ=0.75 M=0.33 FC=0.5
.MODEL qmodel npn
+IS=2.88485e-13 BF=126.335 NF=1.2 VAF=30
+IKF=0.132527 ISE=6.51929e-12 NE=1.9601 BR=0.100001
+NR=1.5 VAR=300 IKR=0.0843484 ISC=1.01027e-13
+NC=1.92564 RB=2.61873 IRB=0.2 RBM=2.61873
+RE=0.0001 RC=2.60372 XTB=0 XTI=4 EG=1.206
+CJE=1.13087e-10 VJE=0.95 MJE=0.692676 TF=1e-09
+XTF=1 VTF=10 ITF=0.01 CJC=1.56651e-10
+VJC=0.908287 MJC=0.23 XCJC=0.897966 FC=0.5
+TR=1e-07 PTF=0 KF=0 AF=1
.MODEL q1model npn
+IS=2.88485e-13 BF=126.335 NF=1.2 VAF=30
+IKF=0.132527 ISE=6.51929e-12 NE=1.9601 BR=0.100001
+NR=1.5 VAR=300 IKR=0.0843484 ISC=1.01027e-13
+NC=1.92564 RB=2.61873 IRB=0.2 RBM=2.61873
+RE=0.0001 RC=2.60372 XTB=0 XTI=4 EG=1.206
+CJE=1.13087e-10 VJE=0.95 MJE=0.692676 TF=1e-09
+XTF=1 VTF=10 ITF=0.01 CJC=0
+VJC=0.908287 MJC=0.23 XCJC=0.897966 FC=0.5
+TR=1e-07 PTF=0 KF=0 AF=1
.ENDS tip102
.backanno
.end

* Results of the author's LTspice run, read from the files saved beside the schematic
* Operating Point, zero values left out:
*   V(vpower) = 28 V
*   V(n001) = 22.32 V
*   V(p001) = 20.22 V
*   V(n008) = 20.04 V
*   V(p002) = 19.89 V
*   V(n006) = 19.89 V
*   V(n005) = 20.71 V
*   V(n009) = 15.96 V
*   V(p003) = 14 V
*   V(n003) = 20.12 V
*   V(n002) = 14 V
*   V(n004) = 14 V
*   V(14v) = 14 V
*   V(n007) = 14 V
*   Ic(Q3) = 1.766 mA
*   Ib(Q3) = 5.818 µA
*   Ie(Q3) = -1.772 mA
*   I(R1) = 1.475 A
*   I(R2) = -18.8 µA
*   I(R3) = 2.706 mA
*   I(R4) = 9.545 mA
*   I(R5) = 229.1 µA
*   I(R6) = 223.3 µA
*   I(R7) = 1.964 mA
*   I(R8) = 1.964 mA
*   I(R9) = -1.473 A
*   I(R14) = -7.569 mA
*   I(V1) = -1.487 A
*   I(V2) = -1.2 µA
*   I(V3) = 1.473 A
*   I(V5) = -1.19 µA
*   I(V7) = 1.964 mA
*   Ix(q1:1) = 1.474 A
*   Ix(q1:2) = 711.1 µA
*   Ix(q1:3) = -1.475 A
*   Ix(q2:1) = -62.29 pA
*   Ix(q2:2) = 18.8 µA
*   Ix(q2:3) = -18.8 µA
*   Ix(u1:IN+) = 1.2 µA
*   Ix(u1:IN-) = 1.19 µA
*   Ix(u1:VCC) = 10.17 mA
*   Ix(u1:VEE) = -2.6 mA
*   Ix(u1:OUT) = -7.569 mA
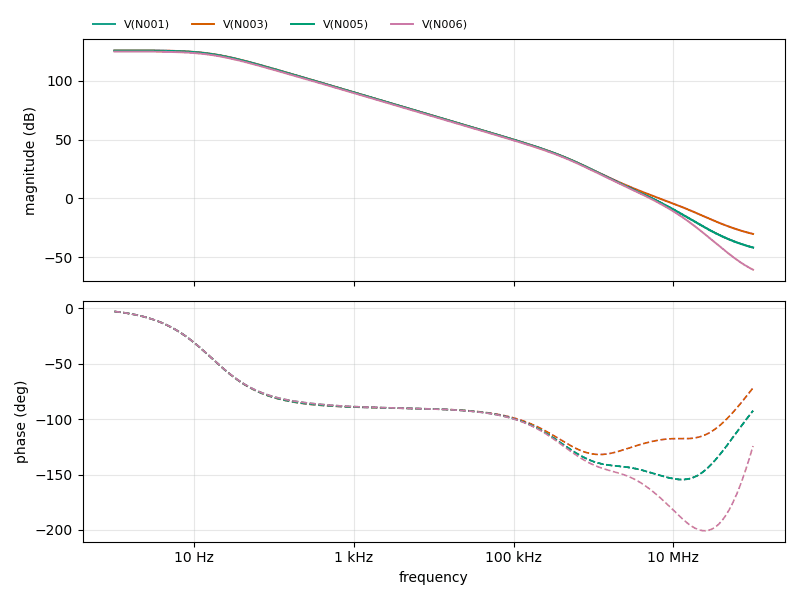
[diagram p3: AC Analysis of compensator.asc, plotted from the saved traces]
* AC Analysis, 1 run:
*   V(N001): 125.27 dB at 1 Hz, -41.79 dB at 100 MHz, peak 125.29 dB at 1.567 Hz, 3 dB below the peak at 16.81 Hz
*   V(N003): 125.67 dB at 1 Hz, -30.19 dB at 100 MHz, peak 125.68 dB at 1.567 Hz, 3 dB below the peak at 16.81 Hz
*   V(N005): 125.52 dB at 1 Hz, -41.79 dB at 100 MHz, peak 125.54 dB at 1.567 Hz, 3 dB below the peak at 16.81 Hz
*   V(N006): 124.68 dB at 1 Hz, -60.57 dB at 100 MHz, peak 124.70 dB at 1.567 Hz, 3 dB below the peak at 16.81 Hz